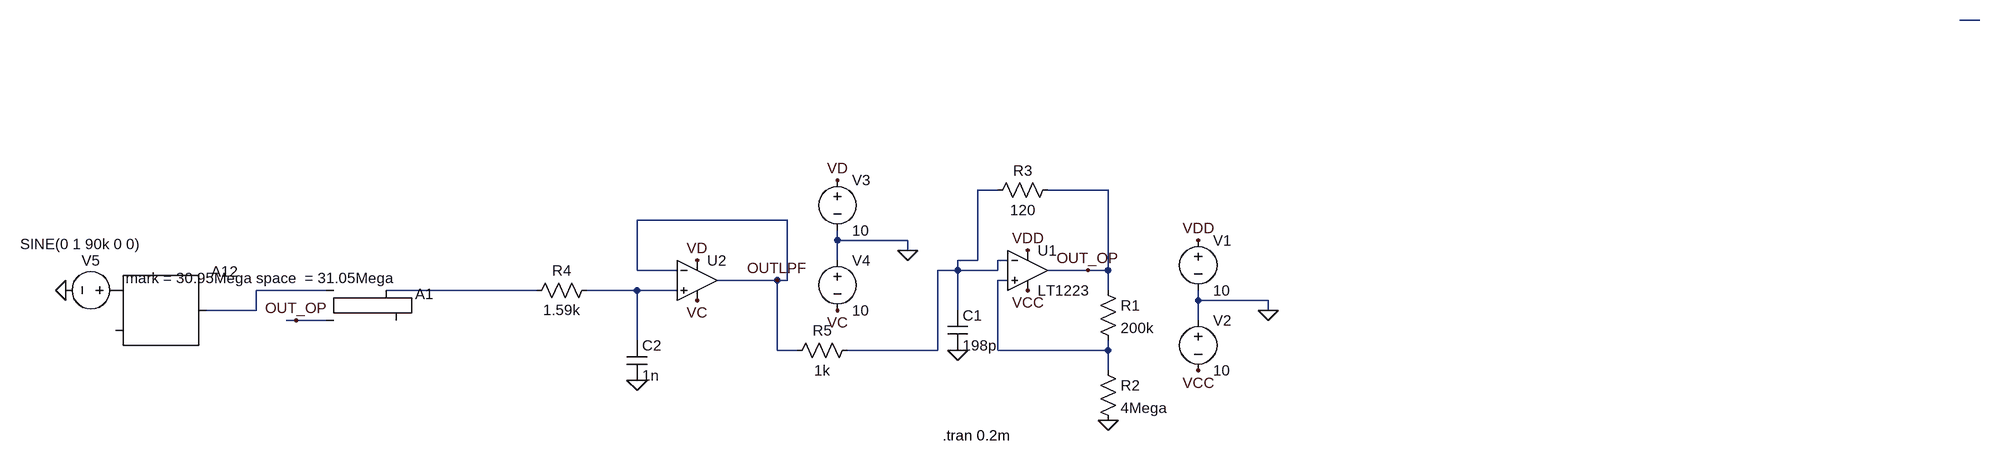
[diagram p0: schematic PLL-Yoav_final.asc]
PLL-Yoav_final.asc, the LTspice schematic file:
Version 4
SHEET 1 2084 812
WIRE 1696 -256 1664 -256
WIRE 128 16 96 16
WIRE 304 16 208 16
WIRE -208 64 -448 64
WIRE -128 96 -128 80
WIRE -16 96 -128 96
WIRE -16 112 -16 96
WIRE -128 128 -128 96
WIRE 96 128 96 16
WIRE 96 128 64 128
WIRE 144 128 128 128
WIRE -448 144 -448 64
WIRE -384 144 -448 144
WIRE 64 144 64 128
WIRE 64 144 32 144
WIRE 128 144 128 128
WIRE 128 144 64 144
WIRE 272 144 208 144
WIRE 304 144 304 16
WIRE 304 144 272 144
WIRE -224 160 -320 160
WIRE -208 160 -208 64
WIRE -208 160 -224 160
WIRE 144 160 128 160
WIRE -944 176 -1056 176
WIRE -608 176 -848 176
WIRE -448 176 -528 176
WIRE -384 176 -448 176
WIRE 304 176 304 144
WIRE 448 192 448 176
WIRE 560 192 448 192
WIRE -1056 208 -1056 176
WIRE -1056 208 -1136 208
WIRE 64 208 64 144
WIRE 560 208 560 192
WIRE -992 224 -1008 224
WIRE -944 224 -992 224
WIRE 448 224 448 192
WIRE -448 256 -448 176
WIRE -224 272 -224 160
WIRE -192 272 -224 272
WIRE 32 272 32 144
WIRE 32 272 -112 272
WIRE 128 272 128 160
WIRE 304 272 304 256
WIRE 304 272 128 272
WIRE 304 304 304 272
FLAG 64 272 0
FLAG 560 208 0
FLAG 448 96 VDD
FLAG 448 304 VCC
FLAG 176 112 VDD
FLAG 176 176 VCC
FLAG 272 144 OUT_OP
FLAG -16 112 0
FLAG -128 0 VD
FLAG -128 208 VC
FLAG -448 320 0
FLAG -352 128 VD
FLAG -352 192 VC
FLAG -224 160 OUTLPF
FLAG -1360 176 0
FLAG 304 384 0
FLAG -992 224 OUT_OP
SYMBOL res 288 160 R0
SYMATTR InstName R1
SYMATTR Value 200k
SYMBOL res 288 288 R0
SYMATTR InstName R2
SYMATTR Value 4Mega
SYMBOL res 224 0 R90
WINDOW 0 0 56 VBottom 2
WINDOW 3 32 56 VTop 2
SYMATTR InstName R3
SYMATTR Value 120
SYMBOL cap 48 208 R0
SYMATTR InstName C1
SYMATTR Value 198p
SYMBOL voltage 448 80 R0
WINDOW 123 0 0 Left 0
WINDOW 39 0 0 Left 0
SYMATTR InstName V1
SYMATTR Value 10
SYMBOL voltage 448 208 R0
WINDOW 123 0 0 Left 0
WINDOW 39 0 0 Left 0
SYMATTR InstName V2
SYMATTR Value 10
SYMBOL voltage -128 -16 R0
SYMATTR InstName V3
SYMATTR Value 10
SYMBOL voltage -128 112 R0
SYMATTR InstName V4
SYMATTR Value 10
SYMBOL OpAmps\\UniversalOpAmp2 -352 160 R0
SYMATTR InstName U2
SYMBOL res -512 160 R90
WINDOW 0 0 56 VBottom 2
WINDOW 3 32 56 VTop 2
SYMATTR InstName R4
SYMATTR Value 1.59k
SYMBOL cap -464 256 R0
SYMATTR InstName C2
SYMATTR Value 1n
SYMBOL Digital\\srflop -896 128 R0
SYMATTR InstName A1
SYMBOL voltage -1264 176 R90
WINDOW 0 -32 56 VBottom 2
WINDOW 3 -90 73 VTop 2
WINDOW 123 0 0 Left 0
WINDOW 39 0 0 Left 0
SYMATTR InstName V5
SYMATTR Value SINE(0 1 90k 0 0)
SYMBOL SpecialFunctions\\modulate -1280 176 R0
WINDOW 3 16 -20 Left 2
SYMATTR Value mark = 30.95Mega space  = 31.05Mega
SYMATTR InstName A12
SYMBOL OpAmps\\LT1223 176 80 R0
SYMATTR InstName U1
SYMBOL res -96 256 R90
WINDOW 0 0 56 VBottom 2
WINDOW 3 32 56 VTop 2
SYMATTR InstName R5
SYMATTR Value 1k
TEXT 40 408 Left 2 !.tran 0.2m

The netlist it stands for:
* PLL-Yoav_final.asc
R1 OUT_OP N003 200k
R2 N003 0 4Mega
R3 OUT_OP N002 120
C1 N002 0 198p
V1 VDD 0 10
V2 0 VCC 10
V3 VD 0 10
V4 0 VC 10
XU2 N006 OUTLPF VD VC OUTLPF level2 Avol=1Meg GBW=10Meg Slew=10Meg Ilimit=25m Rail=0 Vos=0 En=0 Enk=0 In=0 Ink=0 Rin=500Meg  ; pins In+ In- V+ V- OUT
R4 N006 N005 1.59k
C2 N006 0 1n
A1 N004 OUT_OP 0 0 0 0 N005 0 SRFLOP
V5 P001 0 SINE(0 1 90k 0 0)
A12 P001 0 0 0 0 0 N004 0 MODULATOR mark = 30.95Mega space  = 31.05Mega
XU1 N003 N002 VDD VCC OUT_OP LT1223  ; pins In+ In- V+ V- OUT
R5 N002 OUTLPF 1k
.tran 0.2m
.lib UniversalOpAmp2.lib
.backanno
.end